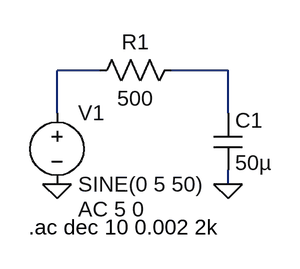
[diagram p0: schematic elecfest_lpf.asc]
elecfest_lpf.asc, the LTspice schematic file:
Version 4.1
SHEET 1 880 680
WIRE 16 48 -32 48
WIRE 160 48 96 48
WIRE -32 96 -32 48
WIRE 160 96 160 48
WIRE 160 176 160 160
FLAG -32 176 0
FLAG 160 176 0
SYMBOL voltage -32 80 R0
WINDOW 123 24 124 Left 2
WINDOW 39 0 0 Left 0
SYMATTR InstName V1
SYMATTR Value SINE(0 5 50)
SYMATTR Value2 AC 5 0
SYMBOL res 112 32 R90
WINDOW 0 0 56 VBottom 2
WINDOW 3 32 56 VTop 2
SYMATTR InstName R1
SYMATTR Value 500
SYMBOL cap 144 96 R0
SYMATTR InstName C1
SYMATTR Value 50µ
TEXT -64 224 Left 2 !.ac dec 10 0.002 2k

The netlist it stands for:
* elecfest_lpf.asc
V1 N001 0 SINE(0 5 50) AC 5 0
R1 N002 N001 500
C1 N002 0 50µ
.ac dec 10 0.002 2k
.backanno
.end